# Altium schematic sheet RS3232.SchDoc: Serial Connection Using RS3232
size B; Date: 2015-01-16; Author: Marcin Czajkowski; CompanyName: Conestoga College; DrawnBy: Marcin Czajkowski; Organization: Marcin Czajkowski; Address1: SN: 3547684; Address2: ESE-Y2; Address3: Conestoga College; Address4: Project IV; DocumentNumber: 1; Revision: A; SheetNumber: 2; SheetTotal: 14; ProjectName: Serial Connection Using RS3232
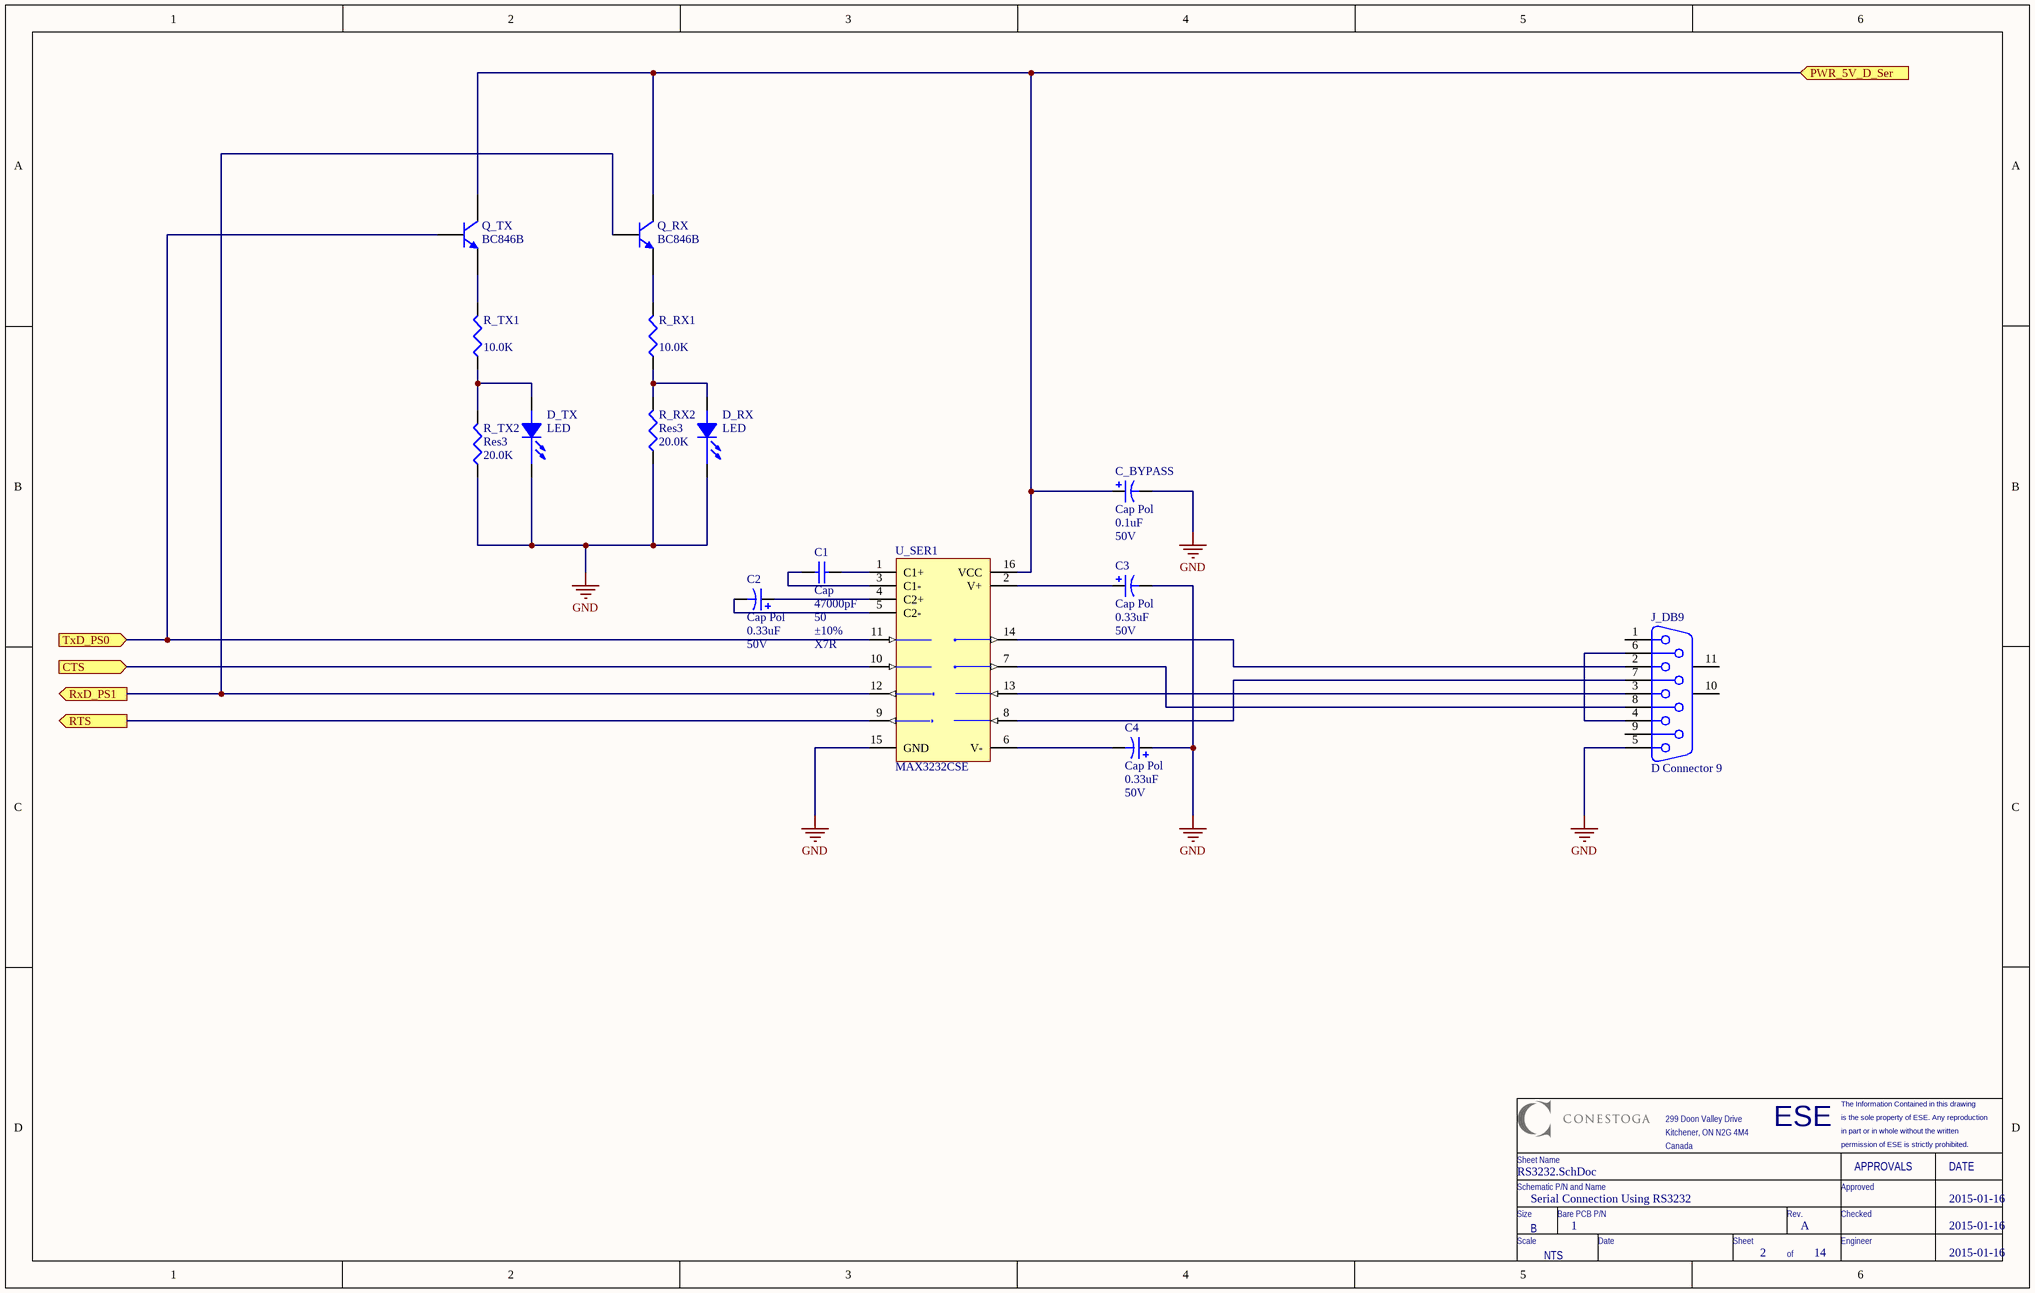
[diagram p0: RS3232.SchDoc]

## Parts
C1  Cap  value 47000pF  WV: 50  Tolerance: ±10%  Type: X7R  [CAPC2012X09M]
C2  Cap Pol  value 0.33uF  Voltage: 50V  [CAPACITOR_3MM]
C3  Cap Pol  value 0.33uF  Voltage: 50V  [CAPACITOR_3MM]
C4  Cap Pol  value 0.33uF  Voltage: 50V  [CAPACITOR_3MM]
C_BYPASS  Cap Pol  value 0.1uF  Voltage: 50V  [CAPACITOR_3MM]
D_RX  LED  [0603]
D_TX  LED  [0603]
J_DB9  D Connector 9  [DSUB1.385-2H9]
Q_RX  BC846B  [SOT95P230X110-3M]
Q_TX  BC846B  [SOT95P230X110-3M]
R_RX1  value 10.0K  [RESC2112X05M]  (hidden comment: Res3)
R_RX2  Res3  value 20.0K  [RESC2112X05M]
R_TX1  value 10.0K  [RESC2112X05M]  (hidden comment: Res3)
R_TX2  Res3  value 20.0K  [RESC2112X05M]
U_SER1  MAX3232CSE  [NSO16_N]

## Ports
CTS (in), PWR_5V_D_Ser (in), RTS (out), RxD_PS1 (out), TxD_PS0 (in)

## Nets
GND: C3.2 C4.1 C_BYPASS.2 D_RX.2(C) D_TX.2(C) J_DB9.5 R_RX2.1 R_TX2.1 U_SER1.15(GND)
CTS: U_SER1.10(T2IN) ; port CTS
PWR_5V_D_Ser: C_BYPASS.1 Q_RX.3(C) Q_TX.3(C) U_SER1.16(VCC) ; port PWR_5V_D_Ser
RTS: U_SER1.9(R2OUT) ; port RTS
RxD_PS1: Q_RX.1(B) U_SER1.12(R1OUT) ; port RxD_PS1
TxD_PS0: Q_TX.1(B) U_SER1.11(T1IN) ; port TxD_PS0
NetC1_1: C1.1 U_SER1.3(C1-)
NetC1_2: C1.2 U_SER1.1(C1+)
NetC2_1: C2.1 U_SER1.4(C2+)
NetC2_2: C2.2 U_SER1.5(C2-)
NetC3_1: C3.1 U_SER1.2(V+)
NetC4_2: C4.2 U_SER1.6(V-)
NetD_RX_1: D_RX.1(A) R_RX1.1 R_RX2.2
NetD_TX_1: D_TX.1(A) R_TX1.1 R_TX2.2
NetJ_DB9_2: J_DB9.2 U_SER1.14(T1OUT)
NetJ_DB9_3: J_DB9.3 U_SER1.13(R1IN)
NetJ_DB9_4: J_DB9.4 J_DB9.6
NetJ_DB9_7: J_DB9.7 U_SER1.8(R2IN)
NetJ_DB9_8: J_DB9.8 U_SER1.7(T2OUT)
NetQ_RX_2: Q_RX.2(E) R_RX1.2
NetQ_TX_2: Q_TX.2(E) R_TX1.2

Not connected (* = marked no-connect by the designer): J_DB9 1 9 10(MH1) 11(MH2)

## Notes on the sheet
- ESE
- is the sole property of ESE. Any reproduction
- The Information Contained in this drawing
- Schematic P/N and Name
- Sheet Name
- 299 Doon Valley Drive
- Kitchener, ON N2G 4M4
- Canada
- Approved
- in part or in whole without the written
- permission of ESE is strictly prohibited.
- APPROVALS
- DATE
- Size
- Scale
- B
- NTS
- Bare PCB P/N
- Date
- Sheet
- Rev.
- Checked
- Engineer
- of

## Library data of the parts
C1 = CAP-X7R-47000pF-50V-±10%: CAP CER 47000pF 50v X7R 0805; MPN: C0805C473K5RACTU; PN: 399-1166-1-ND; Name: CAP-X7R-47000pF-50V-±10%; URL: http://www.digikey.ca/product-detail/en/C0805C473K5RACTU/399-1166-1-ND
C2-C4 = Cap Polar-0.33uF-50V: CAP 85C 0.33uF ±20% 50V WX Series Aluminum Electrolytic; MPN: UWX1HR33MCL2GB; Tan Theta: 0.12; Leakage Current: 3; Rated Ripple Current: 2.8; PN: 493-2125-1-ND; Name: Cap Polar-0.33uF-50V; Diameter: 3; URL: http://www.digikey.ca/product-detail/en/UWX1HR33MCL2GB/493-2125-1-ND
C_BYPASS = Cap Polar-0.1uF-50V: CAP 85C 0.1uF ±20% 50V WX Series Aluminum Electrolytic; MPN: UWX1H0R1MCL2GB; Tan Theta: 0.12; Leakage Current: 3; Rated Ripple Current: 1; PN: 493-2121-1-ND; Name: Cap Polar-0.1uF-50V; Diameter: 3; URL: http://www.digikey.ca/product-detail/en/UWX1H0R1MCL2GB/493-2121-1-ND
J_DB9 = D Connector 9: Receptacle Assembly, 9 Position, Right Angle; MPN: ADF09A-KG-TASB3-R; PN: AE10921-ND; URL: http://www.digikey.ca/product-detail/en/ADF09A-KG-TASB3-R/AE10921-ND
Q_RX Q_TX = BC846B: NPN General Purpose Amplifier; PN: 568-1632-1-ND; URL: http://www.digikey.ca/product-detail/en/BC846B,215/568-1632-1-ND/763459
R_RX1 R_TX1 = Resistor_10.0K: RES SMD 10.0K OHM 1% 1/8W 0805; MPN: CRCW080510K0FKEA; PN: 541-10.0KCCT-ND; Name: Resistor_10.0K; URL: http://www.digikey.ca/product-detail/en/CRCW080510K0FKEA/541-10.0KCCT-ND
R_RX2 R_TX2 = Resistor_20.0K: RES SMD 20.0K OHM 1% 1/8W 0805; MPN: CRCW080520K0FKEA; PN: 541-20.0KCCT-ND; Name: Resistor_20.0K; URL: http://www.digikey.ca/product-detail/en/CRCW080520K0FKEA/541-20.0KCCT-ND
U_SER1 = MAX3232CSE: 3.0V TO 5.5V, Low-Power, up to 1Mbps, True RS-232 Transceiver Using Four 0.1µF External Capacitor; MPN: MAX3232CSE+; PN: MAX3232CSE+-ND; Published: 16-Jan-2001; LatestRevisionDate: 13-Apr-2006; LatestRevisionNote: IPC-7351 Footprint Added.; DatasheetVersion: Mar-1999; PackageReference: NSO16; Publisher: Altium Limited; PackageDescription: 16-Pin Small Outline Integrated Circuit 1.27 mm Pitch; Code_JEDEC: MS-012-AC; Code_IPC: SOIC127P600-16; ComponentLink1Description: Manufacturer Link; ComponentLink1URL: http://www.maxim-ic.com/; ComponentLink2Description: Datasheet; ComponentLink2URL: http://pdfserv.maxim-ic.com/en/ds/MAX3222-MAX3241.pdf; URL: http://www.digikey.ca/product-detail/en/MAX3232CSE%2B/MAX3232CSE%2B-ND